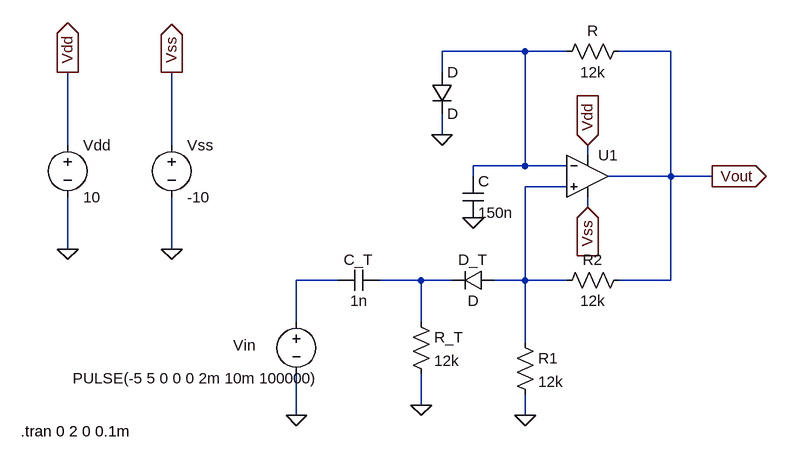
[diagram p0: schematic Draft1.asc]
Draft1.asc, the LTspice schematic file:
Version 4
SHEET 1 880 680
WIRE 144 -32 16 -32
WIRE 208 -32 144 -32
WIRE 368 -32 288 -32
WIRE 16 0 16 -32
WIRE 16 96 16 64
WIRE -560 112 -560 0
WIRE -400 112 -400 0
WIRE 240 128 240 112
WIRE 144 144 144 -32
WIRE 144 144 64 144
WIRE 208 144 144 144
WIRE 64 160 64 144
WIRE 368 160 368 -32
WIRE 368 160 272 160
WIRE 432 160 368 160
WIRE 208 176 144 176
WIRE 240 208 240 192
WIRE -560 272 -560 192
WIRE -400 272 -400 192
WIRE -144 320 -208 320
WIRE -16 320 -80 320
WIRE 32 320 -16 320
WIRE 144 320 144 176
WIRE 144 320 96 320
WIRE 208 320 144 320
WIRE 368 320 368 160
WIRE 368 320 288 320
WIRE -208 384 -208 320
WIRE -16 384 -16 320
WIRE 144 416 144 320
WIRE -16 512 -16 464
WIRE -208 528 -208 464
WIRE 144 528 144 496
FLAG 64 224 0
FLAG 16 96 0
FLAG 144 528 0
FLAG -16 512 0
FLAG -208 528 0
FLAG 240 112 Vdd
IOPIN 240 112 In
FLAG 240 208 Vss
IOPIN 240 208 In
FLAG 432 160 Vout
IOPIN 432 160 Out
FLAG -560 272 0
FLAG -400 272 0
FLAG -560 0 Vdd
IOPIN -560 0 Out
FLAG -400 0 Vss
IOPIN -400 0 Out
SYMBOL OpAmps\\UniversalOpAmp2 240 160 R0
SYMATTR InstName U1
SYMBOL res 304 304 R90
WINDOW 0 0 56 VBottom 2
WINDOW 3 32 56 VTop 2
SYMATTR InstName R2
SYMATTR Value 12k
SYMBOL res 304 -48 R90
WINDOW 0 0 56 VBottom 2
WINDOW 3 32 56 VTop 2
SYMATTR InstName R
SYMATTR Value 12k
SYMBOL cap 48 160 R0
SYMATTR InstName C
SYMATTR Value 150n
SYMBOL diode 0 0 R0
SYMATTR InstName D
SYMBOL res 128 400 R0
SYMATTR InstName R1
SYMATTR Value 12k
SYMBOL diode 96 304 R90
WINDOW 0 0 32 VBottom 2
WINDOW 3 32 32 VTop 2
SYMATTR InstName D_T
SYMBOL res -32 368 R0
SYMATTR InstName R_T
SYMATTR Value 12k
SYMBOL cap -80 304 R90
WINDOW 0 0 32 VBottom 2
WINDOW 3 32 32 VTop 2
SYMATTR InstName C_T
SYMATTR Value 1n
SYMBOL voltage -208 368 R0
WINDOW 0 -97 52 Left 2
WINDOW 3 -344 103 Left 2
WINDOW 123 0 0 Left 0
WINDOW 39 0 0 Left 0
SYMATTR InstName Vin
SYMATTR Value PULSE(-5 5 0 0 0 2m 10m 100000)
SYMBOL voltage -560 96 R0
WINDOW 123 0 0 Left 0
WINDOW 39 0 0 Left 0
SYMATTR InstName Vdd
SYMATTR Value 10
SYMBOL voltage -400 96 R0
WINDOW 123 0 0 Left 0
WINDOW 39 0 0 Left 0
SYMATTR InstName Vss
SYMATTR Value -10
TEXT -632 552 Left 2 !.tran 0 2 0 0.1m

The netlist it stands for:
* Draft1.asc
XU1 N002 N001 Vdd Vss Vout level2 Avol=1Meg GBW=10Meg Slew=10Meg Ilimit=25m Rail=0 Vos=0 En=0 Enk=0 In=0 Ink=0 Rin=500Meg  ; pins In+ In- V+ V- OUT
R2 Vout N002 12k
R Vout N001 12k
C N001 0 150n
D N001 0 D
R1 N002 0 12k
D_T N002 N004 D
R_T N004 0 12k
C_T N004 N003 1n
Vin N003 0 PULSE(-5 5 0 0 0 2m 10m 100000)
Vdd Vdd 0 10
Vss Vss 0 -10
.model D D
.lib standard.dio
.tran 0 2 0 0.1m
.lib UniversalOpAmp2.lib
.backanno
.end